# Altium schematic sheet PwmOut.SchDoc: PwmOut
size A4; Author: Joao Guimaraes; Organization: Altium Limited; Address1: L3, 12a Rodborough Rd; Address2: Frenchs Forest; Address3: NSW; Address4: Australia 2086; Revision: 1.0.0
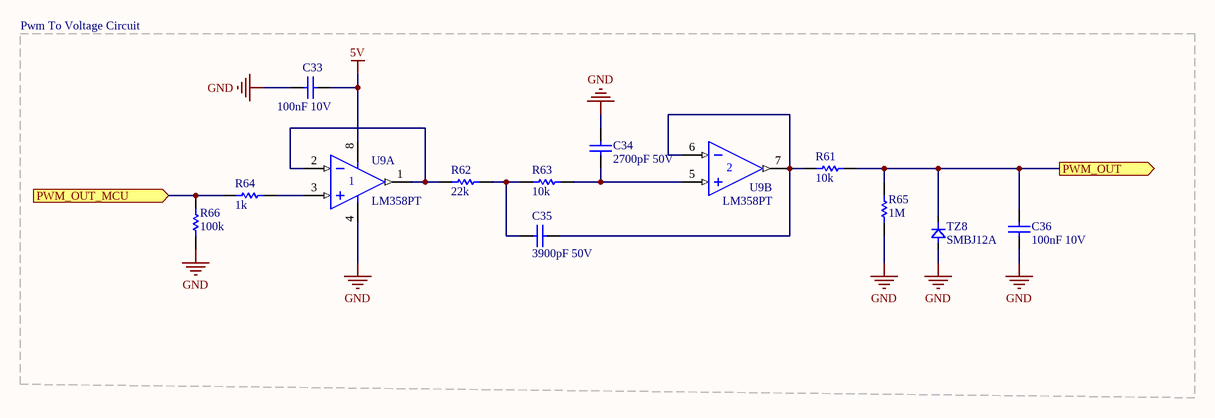
[diagram p0: PwmOut.SchDoc]

## Parts
C33  100nF 10V  [0402]
C34  2700pF 50V  [C0805]
C35  3900pF 50V  [C0805]
C36  100nF 10V  [C0805]
R61  10k  [6-0805_M]
R62  22k  [6-0805_M]
R63  10k  [6-0805_M]
R64  1k  [6-0805_M]
R65  1M  [6-0805_M]
R66  100k  [6-0805_M]
TZ8  SMBJ12A  [DO-214AA]
U9  LM358PT  [TSOP-8]  (parts A,B of 2)

## Blocks framed on the sheet
Pwm To Voltage Circuit: C33-C36 R61-R66 TZ8 U9

## Ports
PWM_OUT (out), PWM_OUT_MCU (in)

## Nets
5V: C33.2 U9.8(Vs+)
GND: C33.1 C34.2 C36.2 R65.1 R66.1 TZ8.1(A) U9.4(Vs-)
PWM_OUT: C36.1 R61.2 R65.2 TZ8.2(C) ; port PWM_OUT
PWM_OUT_MCU: R64.1 R66.2 ; port PWM_OUT_MCU
NetC34_1: C34.1 R63.2 U9.5(IN+)
NetC35_1: C35.1 R62.2 R63.1
NetC35_2: C35.2 R61.1 U9.6(IN-) U9.7(OUT)
NetR62_1: R62.1 U9.1(OUT) U9.2(IN-)
NetR64_2: R64.2 U9.3(IN+)

## Notes on the sheet
- Title:
- Project:
- Date:
- Author:
- Version:
- File:

## Library data of the parts
C33 = Cap: Capacitor; PartNumber: CAP.100n.10V.20%.SMD.0402; Manufacturer: Wurth; ClassName: PwmOut; Price: 0.015; Supplier: Mouser
C34 = Cap: Capacitor; PartNumber: CAP.2700p.50V.10%.SMD.0805; Manufacturer: Vishay; ClassName: PwmOut; Price: 0.10; Supplier: Mouser
C35 = Cap: Capacitor; PartNumber: CAP.3900p.50V.5%.SMD.0805; Manufacturer: Vishay; ClassName: PwmOut; Price: 0.10; Supplier: Mouser
C36 = Cap: Capacitor; PartNumber: CAP.1u.10V.10%.SMD.0805; Manufacturer: Vishay; ClassName: PowerSupplies; Price: 0.17; Supplier: Mouser
R61 R63 = Res: Resistor; PartNumber: RES.10K.1/8W.5%.SMD.0805; Manufacturer: Yageo; ClassName: PwmOut; Price: 0.012; Supplier: Mouser
R62 = Res: Resistor; PartNumber: RES.22K.1/8W.5%.SMD.0805; Manufacturer: Bourns; ClassName: PwmOut; Price: 0.10; Supplier: Mouser
R64 = Res: Resistor; PartNumber: RES.1K.1/8W.5%.SMD.0805; Manufacturer: Yageo; ClassName: PwmOut; Price: 0.012; Supplier: Mouser
R65 = Res: Resistor; PartNumber: RES.1M.1/8W.5%.SMD.0805; Manufacturer: Bourns; ClassName: PwmOut; Price: 0.012; Supplier: Mouser
R66 = Res: Resistor; PartNumber: RES.100K.1/8W.5%.SMD.0805; Manufacturer: Yageo; ClassName: PwmOut; Price: 0.012; Supplier: Mouser
TZ8 = SMBJ12A: ESD Suppressors / TVS Diodes 12V 600W SMB Unidirectional; pin to pad: 1>A 2>C; Manufacturer: ON Semiconductor; ClassName: PwmOut; PartNumber: SMBJ12A; Price: 0.37; Supplier: Mouser
U9 = LM358PT: Operational Amplifiers - Op Amps Dual Low Power; Manufacturer: STMicroelectronics; ClassName: PwmOut; PartNumber: LM358PT; Price: 0.40; Supplier: Mouser